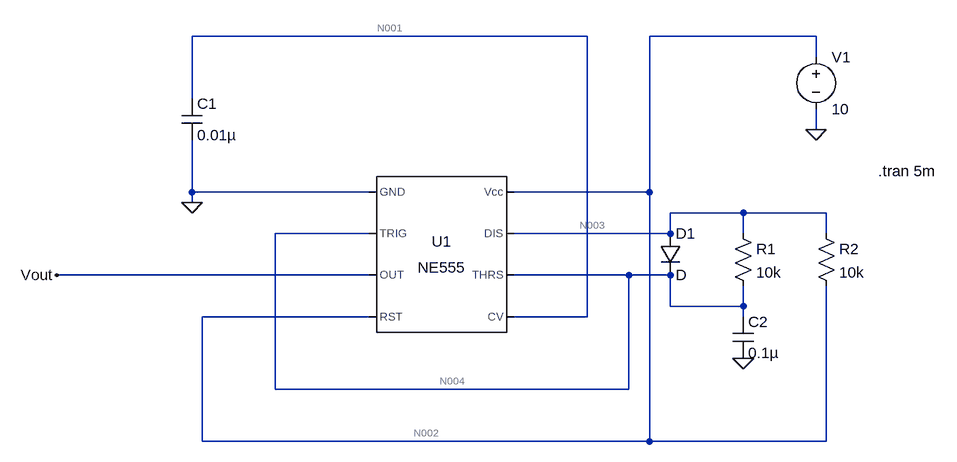
[diagram p0: schematic Astable Symmetrical.asc]
Astable Symmetrical.asc, the LTspice schematic file:
Version 4
SHEET 1 952 680
WIRE 400 -176 -208 -176
WIRE 752 -176 496 -176
WIRE 752 -144 752 -176
WIRE -208 -80 -208 -176
WIRE 752 -32 752 -64
WIRE -208 64 -208 -16
WIRE 64 64 -208 64
WIRE 496 64 496 -176
WIRE 496 64 288 64
WIRE -208 80 -208 64
WIRE 640 96 528 96
WIRE 768 96 640 96
WIRE 64 128 -80 128
WIRE 528 128 528 96
WIRE 528 128 288 128
WIRE 640 128 640 96
WIRE 768 128 768 96
WIRE 64 192 -416 192
WIRE 464 192 288 192
WIRE 528 192 464 192
WIRE 528 240 528 192
WIRE 640 240 640 208
WIRE 640 240 528 240
WIRE 64 256 -192 256
WIRE 400 256 400 -176
WIRE 400 256 288 256
WIRE 640 256 640 240
WIRE -80 368 -80 128
WIRE 464 368 464 192
WIRE 464 368 -80 368
WIRE -192 448 -192 256
WIRE 496 448 496 64
WIRE 496 448 -192 448
WIRE 768 448 768 208
WIRE 768 448 496 448
FLAG -208 80 0
FLAG -416 192 Vout
FLAG 640 320 0
FLAG 752 -32 0
SYMBOL Misc\\NE555 176 160 R0
SYMATTR InstName U1
SYMBOL cap -224 -80 R0
SYMATTR InstName C1
SYMATTR Value 0.01µ
SYMBOL diode 512 128 R0
SYMATTR InstName D1
SYMBOL res 624 112 R0
SYMATTR InstName R1
SYMATTR Value 10k
SYMBOL res 752 112 R0
SYMATTR InstName R2
SYMATTR Value 10k
SYMBOL cap 624 256 R0
SYMATTR InstName C2
SYMATTR Value 0.1µ
SYMBOL voltage 752 -160 R0
WINDOW 123 0 0 Left 0
WINDOW 39 0 0 Left 0
SYMATTR InstName V1
SYMATTR Value 10
TEXT 848 32 Left 2 !.tran 5m

The netlist it stands for:
* Astable Symmetrical.asc
XU1 0 N004 Vout N002 N001 N004 N003 N002 NE555  ; pins GND TRIG OUT RST CV THRS DIS Vcc
C1 N001 0 0.01µ
D1 N003 N004 D
R1 N003 N004 10k
R2 N003 N002 10k
C2 N004 0 0.1µ
V1 N002 0 10
.model D D
.lib standard.dio
.tran 5m
.lib NE555.sub
.backanno
.end

* Results of the author's LTspice run, read from the files saved beside the schematic
* Operating Point, zero values left out:
*   V(n004) = 9.999 V
*   V(n001) = 6.667 V
*   V(n002) = 10 V
*   V(n003) = 10 V
*   V(vout) = 10 V
*   I(R2) = -33.34 nA
*   I(R1) = 20 nA
*   I(V1) = -3.233 mA
*   Ix(u1:1) = -3.233 mA
*   Ix(u1:2) = 9.999 nA
*   Ix(u1:4) = 56 µA
*   Ix(u1:6) = 9.999 nA
*   Ix(u1:7) = 13.34 nA
*   Ix(u1:8) = 3.177 mA
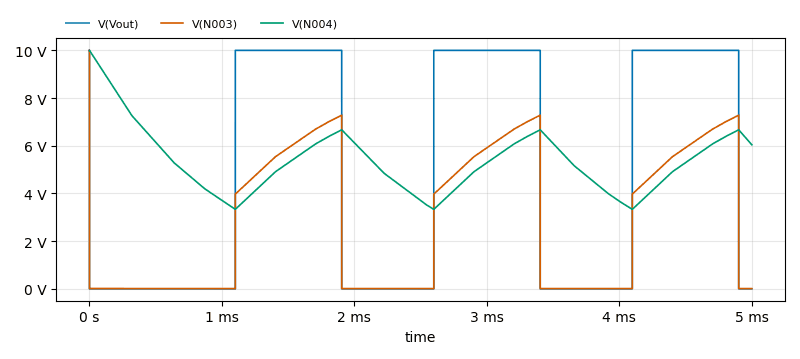
[diagram p1: Transient Analysis of Astable Symmetrical.asc, plotted from the saved traces]
* Transient Analysis, 1 run:
*   V(Vout): min 60 µV, max 10 V, average 4.819 V, rms 6.942 V, last 60 µV
*   V(N003): min 7.99 mV, max 10 V, average 2.81 V, rms 4.11 V, last 9.611 mV
*   V(N004): min 3.332 V, max 9.999 V, average 5.32 V, rms 5.514 V, last 6.038 V